# Altium project Safety_Status_Indicator.PrjPcb
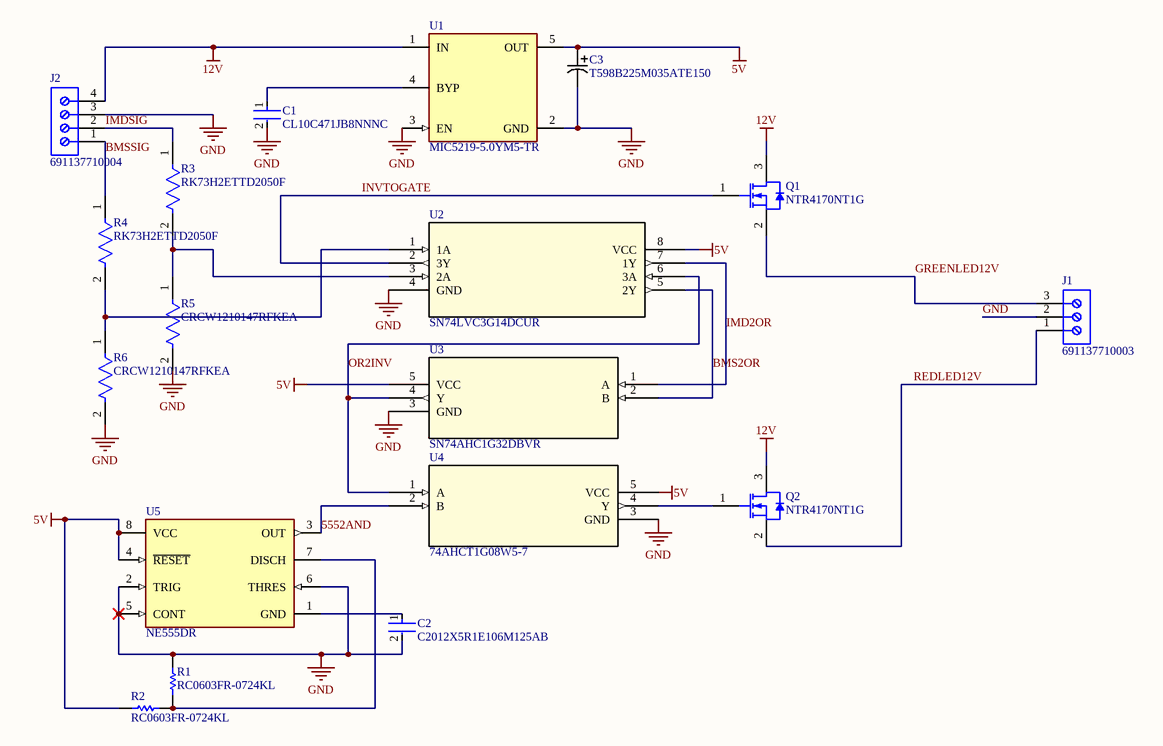
[diagram p0: Safety_Status_Indicator.SchDoc]
1 sheet, 18 parts. Net scope: global (net labels, ports and power ports of the same name join across sheets).
Board file: PCB1.PcbDoc

## Sheet Safety_Status_Indicator.SchDoc
size A4; SheetNumber: 1; SheetTotal: 1

### Parts
C1  CL10C471JB8NNNC  [FP-CL10-IPC_A]
C2  C2012X5R1E106M125AB  [FP-C2012-125-0_2-MFG]
C3  T598B225M035ATE150  [CAPMP3.7X2.8_2.1N_KEM]
J1  691137710003  [691137710003]
J2  691137710004  [691137710004]
Q1  NTR4170NT1G  [ONSC-SOT-23-3-318-08_V]
Q2  NTR4170NT1G  [ONSC-SOT-23-3-318-08_V]
R1  RC0603FR-0724KL  [RESC1608X55X25NL10T15]
R2  RC0603FR-0724KL  [RESC1608X55X25NL10T15]
R3  RK73H2ETTD2050F  [FP-RK73H2E-MFG]
R4  RK73H2ETTD2050F  [FP-RK73H2E-MFG]
R5  CRCW1210147RFKEA  [FP-CRCW1210-e3-IPC_B]
R6  CRCW1210147RFKEA  [FP-CRCW1210-e3-IPC_B]
U1  MIC5219-5.0YM5-TR  [FP-SOT23-5LD-PL-1-MFG]
U2  SN74LVC3G14DCUR  [DCU8_TEX]
U3  SN74AHC1G32DBVR  [DBV5]
U4  74AHCT1G08W5-7  [SOT25_DIO]
U5  NE555DR  [FP-D0008A-IPC_A]

### Nets
5V: C3.1 R2.1 U1.5(OUT) U2.8(VCC) U3.5(VCC) U4.5(VCC) U5.4(~{RESET}) U5.8(VCC)
12V: J2.4 Q1.3(D) Q2.3(D) U1.1(IN)
GND: C1.2 C2.2 C3.2 J1.2 J2.3 R1.2 R5.2 R6.2 U1.2(GND) U1.3(EN) U2.4(GND) U3.3(GND) U4.3(GND) U5.2(TRIG) U5.5(CONT) U5.6(THRES)
5552AND: U4.2(B) U5.3(OUT)
BMS2OR: U2.5(2Y) U3.2(B)
BMSSIG: J2.1 R4.1
GREENLED12V: J1.3 Q1.2(S)
IMD2OR: U2.7(1Y) U3.1(A)
IMDSIG: J2.2 R3.1
INVTOGATE: Q1.1(G) U2.2(3Y)
OR2INV: U2.6(3A) U3.4(Y) U4.1(A)
REDLED12V: J1.1 Q2.2(S)
NetC1_1: C1.1 U1.4(BYP)
NetC2_1: C2.1 U5.1(GND)
NetQ2_1: Q2.1(G) U4.4(Y)
NetR1_1: R1.1 R2.2 U5.7(DISCH)
NetR3_2: R3.2 R5.1 U2.3(2A)
NetR4_2: R4.2 R6.1 U2.1(1A)

### Library data of the parts
C1 = CMP-13271-001951-1: Cap Ceramic 470pF 50V C0G ±5% Pad SMD 0603 +125°C T/R; Temperature Coefficient: 300ppm/°C; Material: Ceramic; Voltage: 50V; Packaging: Tape and Reel; Max Operating Temperature: 125°C; Min Operating Temperature: -55°C; Height: 0.8mm; Thickness: 0.035inch; Depth: 0.8mm; Width: 0.031inch; Lead Free: Lead Free; Voltage Rating: 50V; Mount: Surface Mount; Case Code (Metric): 1608; Dielectric: C0G; Tolerance: 5%; Case Code (Imperial): 0603; Voltage Rating (DC): 50V; Case/Package: 0603; Package Quantity: 1; Capacitance: 470pF; Radiation Hardening: No; Length: 1.6mm
C2 = CMP-08246-005781-1: Multilayer Ceramic Capacitors 10μF ±20% 25V X5R SMD 0805; Capacitance: 10uF; Series: C; Case Code (Metric): 2012; RoHS Compliant: Yes; Packaging: Tape and Reel; Dielectric Material: Ceramic; Length: 2mm; Package Quantity: 1; Width: 1.2mm; Dielectric: X5R; Tolerance: 20%; Mount: Surface Mount; Weight: 0.000194oz; Voltage Rating: 25V; Case/Package: 0805; Height: 1.25mm; Lead Free: Lead Free; Thickness: 0.057inch; Voltage Rating (DC): 25V; Resistor Type: Ceramic; Min Operating Temperature: -55°C; Case Code (Imperial): 0805; Depth: 1.25mm; Termination: SMD/SMT; Max Operating Temperature: 85°C
C3 = T598B225M035ATE150: No Description Available; Mfr_Name: Kemet
J1 = CMP-002-00076-1: Series 1377 - 5.00 mm Horizontal Entry with Pressure Clamp WR-TBL, 3 pin; RoHS Compliant: Yes
J2 = CMP-1502-03326-2: NexarPartId: 78871140; Packaging: Box; RoHS: Non-Compliant; Number of Pins: 4; Lead Pitch: 5mm
Q1 Q2 = CMP-1058-00736-1: Power MOSFET, 30 V, 3.1 A, Single N-Channe, 3-Pin SOT-23, Pb-Free, Tape and Reel; Manufacturer: On Semiconductor; VGS Max (V): 12; Qrr Typ (nC): 2.9; Ciss Typ (pF): 432; Coss Typ (pF): 53.6; V(BR)DSS Min (V): 30; VGS(th) Max (V): 1.4; Channel Polarity: N Channel; Crss Typ (pF): 37.1; ComponentLink3URL: http://www.onsemi.cn/pub_link/Collateral/318-08.PDF; ComponentLink3Description: Package Specification; RoHS: Pb-Free; PackageVersion: Rev. AP, 11/2009; DatasheetVersion: Rev. 1; PackageDescription: 3-Pin Small Outline Transistor, Body 2.92 x 1.3 mm, Pitch 0.95 mm; ComponentLink2Description: Datasheet; ComponentLink2URL: http://www.onsemi.cn/pub_link/Collateral/NTR4170N-D.PDF; Package Type: SOT-23-3; PartNumber: NTR4170NT1G; ComponentLink1Description: Manufacturer URL; Mounting Technology: Surface Mount; Packing: Tape and Reel; Configuration: Single; PackageReference: SOT-23-3-318-08; ComponentLink1URL: http://www.onsemi.com/
R1 R2 = CMP-2000-03968-1: Manufacturer: Yageo; Part Number: RC0603FR-0724KL
R3 R4 = CMP-2005-02687-2: 205Ω ±1% 0.5W Chip Resistor 1210 Thick Film AEC-Q200 Qualified; Resistance: 205R; Power Rating: 500mW; Temperature Coefficient: 100ppm/°C; Voltage Rating: 200V; Max Operating Temperature: 155°C; Lead Free: Lead Free; Height: 0.6mm; Case Code (Imperial): 1210; Length: 3.2mm; Packaging: Tape and Reel; Case Code (Metric): 3225; Military Standard: Not; Min Operating Temperature: -55°C; Case/Package: 1210; Depth: 2.6mm; Width: 2.6mm; Resistor Type: Thick Film; Termination: SMD/SMT; Package Quantity: 5000; Construction: Rectangular; Series: RK73H; Tolerance: 1%; RoHS Compliant: Yes
R5 R6 = CMP-2005-00392-2: RES SMD 205K OHM 1% 1/2W 1902; Temperature Coefficient: 100ppm/°C; Voltage Rating: 200V; Max Power Dissipation: 500mW; Resistance: 147R; Min Operating Temperature: -55°C; Contact Plating: Tin; Radiation Hardening: No; Case Code (Metric): 3225; Termination: SMD/SMT; Length: 0.126inch; Packaging: Tape and Reel; Case/Package: 1210; Power Rating: 500mW; Max Operating Temperature: 155°C; Width: 2.5mm; Lead Free: Lead Free; Package Quantity: 5000; Height: 0.024inch; Tolerance: 1%; Features: Automotive AEC-Q200; Composition: Thick Film; Voltage Rating (DC): 200V; Weight: 0.000564oz; Number of Terminations: 2; Case Code (Imperial): 1210
U1 = CMP-06324-000019-1: IC REG LINEAR 5V 500MA SOT23-5; Manufacturer: Microchip Technology; Number Of Outputs: 1; Accuracy Percentage: 1%; Min Supply Voltage: 2.5V; Dropout Voltage: 350mV; Nominal Supply Current: 80-12000uA; Standoff Height: 0mm; Max Junction Temp: +125°C; Output Type: Fixed; Max Supply Voltage: 12V; ComponentLink2Description: Datasheet; Manufacturer Part Number: MIC5219-5.0YM5-TR; Category: IC; Height: 1.45mm; Temperature: -40°C to +125°C; Device Class L1: Integrated Circuits (ICs); Device Class L3: Voltage Regulators - Linear; Octopart: https://octopart.com/mic5219-5.0ym5-tr-microchip-66802269; Output Current: 500mA; Temperature Range Low: -40°C; Lead Free: Yes; Package: SOT23-5LD-PL-1; Automotive: No; Ambient Temperature Range High: +125°C; ComponentLink2URL: http://ww1.microchip.com/downloads/en/DeviceDoc/MIC5219-500mA-Peak-Output-LDO-Regulator-DS20006021A.pdf; Output Voltage: 5V; Temperature Range High: +125°C; Digikey Description: IC REG LINEAR 5V 500MA SOT23-5; Ambient Temperature Range Low: -40°C; RoHS: TRUE; Mouser Description: IC REG LINEAR 5V 500MA SOT23-5; Device Class L2: Power Management ICs
U2 = SN74LVC3G14DCUR: No Description Available; Mfr_Name: Texas Instruments; RefDes: RefDes; Type: Type
U3 = SN74AHC1G32DBVR: Logic OR gate; Mfr_Name: Texas Instruments; RefDes: RefDes; Type: Type
U4 = 74AHCT1G08W5-7: No Description Available; Mfr_Name: Diodes Inc; RefDes: RefDes; Type: Type
U5 = CMP-1685-00007-2: IC OSC SGL TIMER 100KHZ 8-SOIC; Low Level Output Current: 200mA; Quiescent Current: 15mA; Min Supply Voltage: 4.5V; Number of Timers/Counters: 1; Max Supply Voltage: 16V; Operating Supply Current: 10mA; High Level Output Current: -200mA; Packaging: Tape and Reel; Frequency: 100kHz; Weight: 0.002561oz; REACH SVHC: No SVHC; Package Quantity: 2500; Width: 3.91mm; Max Operating Temperature: 70°C; Contact Plating: Gold; Lead Free: Lead Free; Number of Pins: 8; Min Operating Temperature: 0°C; Radiation Hardening: No; Length: 4.9mm; Case/Package: SOIC; Height: 1.58mm; Mount: Surface Mount